# EAGLE design PDTSetup with 3535 (EAGLE 9.0.0)
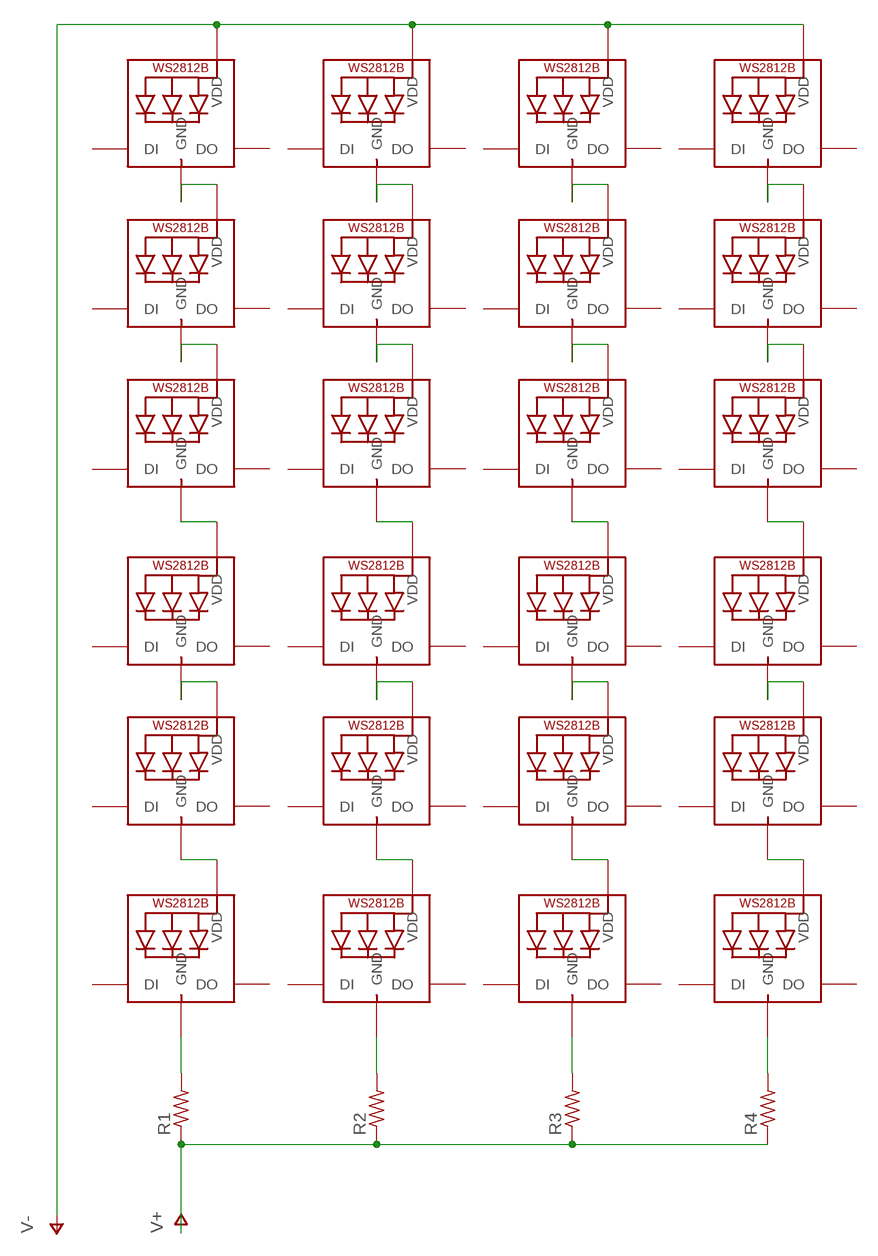
[diagram p0: schematic, sheet 1]

## Parts
LED1  WS2812B3535  [LED3535]
LED2  WS2812B3535  [LED3535]
LED3  WS2812B3535  [LED3535]
LED4  WS2812B3535  [LED3535]
LED5  WS2812B3535  [LED3535]
LED6  WS2812B3535  [LED3535]
LED7  WS2812B3535  [LED3535]
LED8  WS2812B3535  [LED3535]
LED9  WS2812B3535  [LED3535]
LED10  WS2812B3535  [LED3535]
LED11  WS2812B3535  [LED3535]
LED12  WS2812B3535  [LED3535]
LED13  WS2812B3535  [LED3535]
LED14  WS2812B3535  [LED3535]
LED15  WS2812B3535  [LED3535]
LED16  WS2812B3535  [LED3535]
LED17  WS2812B3535  [LED3535]
LED18  WS2812B3535  [LED3535]
LED19  WS2812B3535  [LED3535]
LED20  WS2812B3535  [LED3535]
LED21  WS2812B3535  [LED3535]
LED22  WS2812B3535  [LED3535]
LED23  WS2812B3535  [LED3535]
LED24  WS2812B3535  [LED3535]
R1  R-US_0207/15  [0207/15]
R2  R-US_0207/15  [0207/15]
R3  R-US_0207/15  [0207/15]
R4  R-US_0207/15  [0207/15]

## Nets
N$1: LED24.4(GND) R4.2
N$2: LED13.4(GND) R3.2
N$3: LED12.4(GND) R2.2
N$4: LED6.4(GND) R1.2
N$5: LED5.4(GND) LED6.2(VDD)
N$6: LED11.4(GND) LED12.2(VDD)
N$7: LED13.2(VDD) LED14.4(GND)
N$8: LED23.4(GND) LED24.2(VDD)
N$9: LED4.4(GND) LED5.2(VDD)
N$10: LED10.4(GND) LED11.2(VDD)
N$11: LED14.2(VDD) LED15.4(GND)
N$12: LED22.4(GND) LED23.2(VDD)
N$13: LED21.4(GND) LED22.2(VDD)
N$14: LED15.2(VDD) LED16.4(GND)
N$15: LED9.4(GND) LED10.2(VDD)
N$16: LED3.4(GND) LED4.2(VDD)
N$17: LED2.4(GND) LED3.2(VDD)
N$18: LED8.4(GND) LED9.2(VDD)
N$19: LED16.2(VDD) LED17.4(GND)
N$20: LED20.4(GND) LED21.2(VDD)
N$21: LED19.4(GND) LED20.2(VDD)
N$22: LED17.2(VDD) LED18.4(GND)
N$23: LED7.4(GND) LED8.2(VDD)
N$24: LED1.4(GND) LED2.2(VDD)
V+: R1.1 R2.1 R3.1 R4.1
V-: LED1.2(VDD) LED7.2(VDD) LED18.2(VDD) LED19.2(VDD)
Unconnected: LED1.1(DI) LED1.3(DO) LED2.1(DI) LED2.3(DO) LED3.1(DI) LED3.3(DO) LED4.1(DI) LED4.3(DO) LED5.1(DI) LED5.3(DO) LED6.1(DI) LED6.3(DO) LED7.1(DI) LED7.3(DO) LED8.1(DI) LED8.3(DO) LED9.1(DI) LED9.3(DO) LED10.1(DI) LED10.3(DO) LED11.1(DI) LED11.3(DO) LED12.1(DI) LED12.3(DO) LED13.1(DI) LED13.3(DO) LED14.1(DI) LED14.3(DO) LED15.1(DI) LED15.3(DO) LED16.1(DI) LED16.3(DO) LED17.1(DI) LED17.3(DO) LED18.1(DI) LED18.3(DO) LED19.1(DI) LED19.3(DO) LED20.1(DI) LED20.3(DO) LED21.1(DI) LED21.3(DO) LED22.1(DI) LED22.3(DO) LED23.1(DI) LED23.3(DO) LED24.1(DI) LED24.3(DO)

## Library data of the parts
LED1-LED24 = adafruit:WS2812B
R1-R4 = rcl:R-US_: RESISTOR, American symbol; SPICEPREFIX: R

## Board
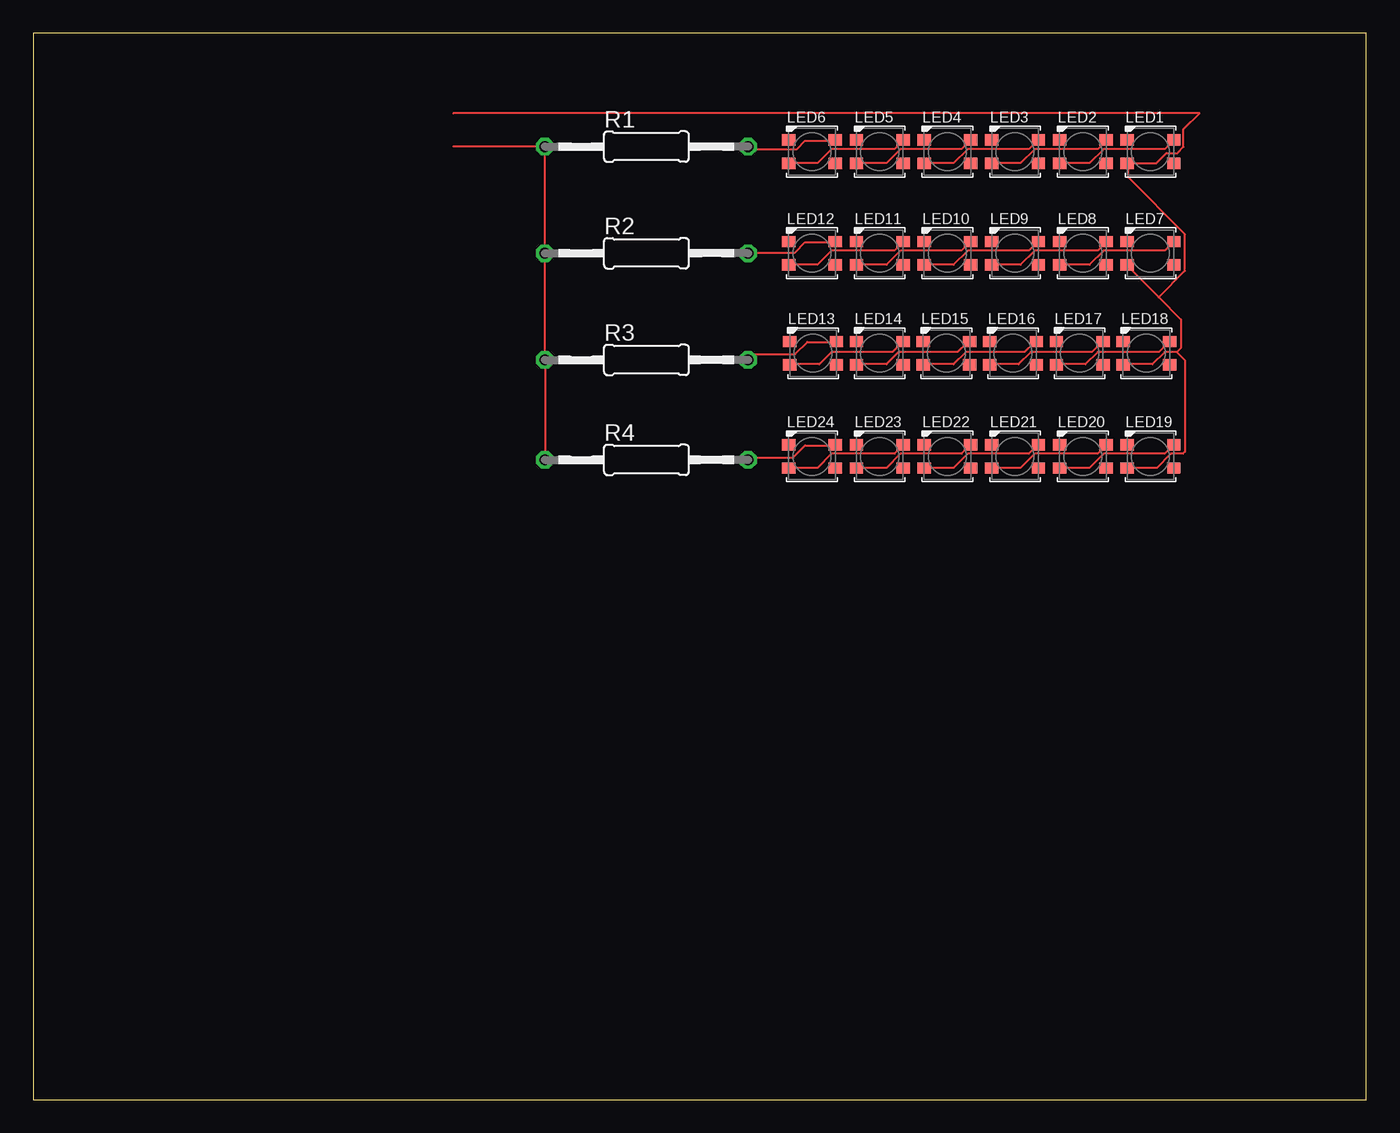
[diagram p1: board, top side]

Size 100 x 80 mm. Coordinates in mm from the lower left corner, seen from the top.
Outline: 0,0 100,0 100,80 0,80 0,0
Copper layers (1*16): Top 0.035mm / dielectric 1.5mm / Bottom 0.035mm
Design rules "default": minimum track width 6mil, minimum drill 0.35mm, track to track 6mil, track to pad 6mil, pad to pad 6mil, via to via 6mil, smd to smd 6mil, copper to edge 40mil, drill to drill 6mil, minimum pad ring 10mil, minimum via ring 8mil, stop-mask expansion 4mil, vias tented up to drill 0mil, thermal gap 10mil

### Footprints (pad centres in the part's own frame; a part is rotated, then mirrored left to right if it is on the bottom)
LED3535 = smd 1 x 0.85: 1 -1.75,0.875; 2 -1.75,-0.875; 3 1.75,-0.875; 4 1.75,0.875
0207/15 = drill 0.813 octagon: 1 -7.62,0; 2 7.62,0

### Placement (x,y rotation side)
LED1  83.82,71.12 0 top
LED2  78.74,71.12 0 top
LED3  73.66,71.12 0 top
LED4  68.58,71.12 0 top
LED5  63.5,71.12 0 top
LED6  58.42,71.12 0 top
LED7  83.82,63.5 0 top
LED8  78.74,63.5 0 top
LED9  73.66,63.5 0 top
LED10  68.58,63.5 0 top
LED11  63.5,63.5 0 top
LED12  58.42,63.5 0 top
LED13  58.5,56 0 top
LED14  63.5,56 0 top
LED15  68.5,56 0 top
LED16  73.5,56 0 top
LED17  78.5,56 0 top
LED18  83.5,56 0 top
LED19  83.82,48.26 0 top
LED20  78.74,48.26 0 top
LED21  73.66,48.26 0 top
LED22  68.58,48.26 0 top
LED23  63.5,48.26 0 top
LED24  58.42,48.26 0 top
R1  46,71.5 0 top
R2  46,63.5 0 top
R3  46,55.5 0 top
R4  46,48 0 top

### Tracks (layer width: path | path; a pad name or v marks a point on that pad's centre or on a via)
N$1
  Top 0.152: LED24.4 60.05,49.07 57.91,49.07 57,48.16 53.8,48.16 53.65,48.01 R4.2
N$2
  Top 0.152: LED13.4 60.2,56.84 58.06,56.84 57.15,55.93 53.95,55.93 53.65,55.63 R3.2
N$3
  Top 0.152: LED12.4 60.05,64.31 57.91,64.31 57.15,63.55 53.65,63.55 R2.2
N$4
  Top 0.152: LED6.4 60.05,71.93 57.91,71.93 57.3,71.32 53.8,71.32 53.65,71.48 R1.2
N$5
  Top 0.152: LED6.2 56.69,70.26 58.83,70.26 59.89,71.32 64.62,71.32 65.23,71.93 LED5.4
N$6
  Top 0.152: LED12.2 56.69,62.64 58.83,62.64 59.89,63.7 64.62,63.7 65.23,64.31 LED11.4
N$7
  Top 0.152: LED13.2 56.84,55.17 58.98,55.17 59.89,56.08 64.47,56.08 65.23,56.84 LED14.4
N$8
  Top 0.152: LED24.2 56.69,47.4 58.83,47.4 59.89,48.46 64.62,48.46 65.23,49.07 LED23.4
N$9
  Top 0.152: LED5.2 61.87,70.26 64.01,70.26 65.08,71.32 69.65,71.32 70.26,71.93 LED4.4
N$10
  Top 0.152: LED11.2 61.87,62.64 64.01,62.64 65.08,63.7 69.65,63.7 70.26,64.31 LED10.4
N$11
  Top 0.152: LED14.2 61.87,55.17 64.01,55.17 64.92,56.08 69.34,56.08 70.1,56.84 LED15.4
N$12
  Top 0.152: LED23.2 61.87,47.4 64.01,47.4 65.08,48.46 69.65,48.46 70.26,49.07 LED22.4
N$13
  Top 0.152: LED22.2 66.9,47.4 69.04,47.4 70.1,48.46 74.68,48.46 75.29,49.07 LED21.4
N$14
  Top 0.152: LED15.2 66.75,55.17 69.04,55.17 69.95,56.08 74.37,56.08 75.13,56.84 LED16.4
N$15
  Top 0.152: LED10.2 66.9,62.64 69.04,62.64 70.1,63.7 74.68,63.7 75.29,64.31 LED9.4
N$16
  Top 0.152: LED4.2 66.9,70.26 69.04,70.26 70.1,71.32 74.68,71.32 75.29,71.93 LED3.4
N$17
  Top 0.152: LED3.2 71.93,70.26 74.07,70.26 75.13,71.32 79.86,71.32 80.47,71.93 LED2.4
N$18
  Top 0.152: LED9.2 71.93,62.64 74.07,62.64 75.13,63.7 79.86,63.7 80.47,64.31 LED8.4
N$19
  Top 0.152: LED16.2 71.78,55.17 73.91,55.17 74.83,56.08 79.4,56.08 80.16,56.84 LED17.4
N$20
  Top 0.152: LED21.2 71.93,47.4 74.07,47.4 75.13,48.46 79.86,48.46 80.47,49.07 LED20.4
N$21
  Top 0.152: LED20.2 77.11,47.4 79.25,47.4 80.31,48.46 84.89,48.46 85.5,49.07 LED19.4
N$22
  Top 0.152: LED17.2 76.81,55.17 78.94,55.17 79.86,56.08 84.43,56.08 85.19,56.84 LED18.4
N$23
  Top 0.152: LED8.2 77.11,62.64 79.25,62.64 80.31,63.7 84.89,63.7 85.5,64.31 LED7.4
N$24
  Top 0.152: LED2.2 77.11,70.26 79.25,70.26 80.31,71.32 84.89,71.32 85.5,71.93 LED1.4
V+
  Top 0.152: R4.1 38.41,48.01 38.41,55.47 R3.1 38.41,55.63 38.41,63.4 R2.1 38.41,63.55 38.41,71.48 R1.1 31.5,71.5
V-
  Top 0.152: 85.8,56.08 84.89,56.08 83.97,55.17 81.84,55.17 LED18.2 | 85.8,56.08 86.11,56.39 86.11,58.52 84.43,60.2 | 84.43,60.2 82.14,62.48 LED7.2 | 85.8,56.08 86.41,55.47 86.41,48.62 86.26,48.46 85.34,48.46 84.28,47.4 82.14,47.4 LED19.2 | 84.43,60.2 86.41,62.18 86.41,64.92 82.14,69.19 82.14,70.1 LED1.2 84.24,70.25 85.01,71.02 85.84,71.02 86.3,71.47 86.3,72.8 87.5,74 31.5,74